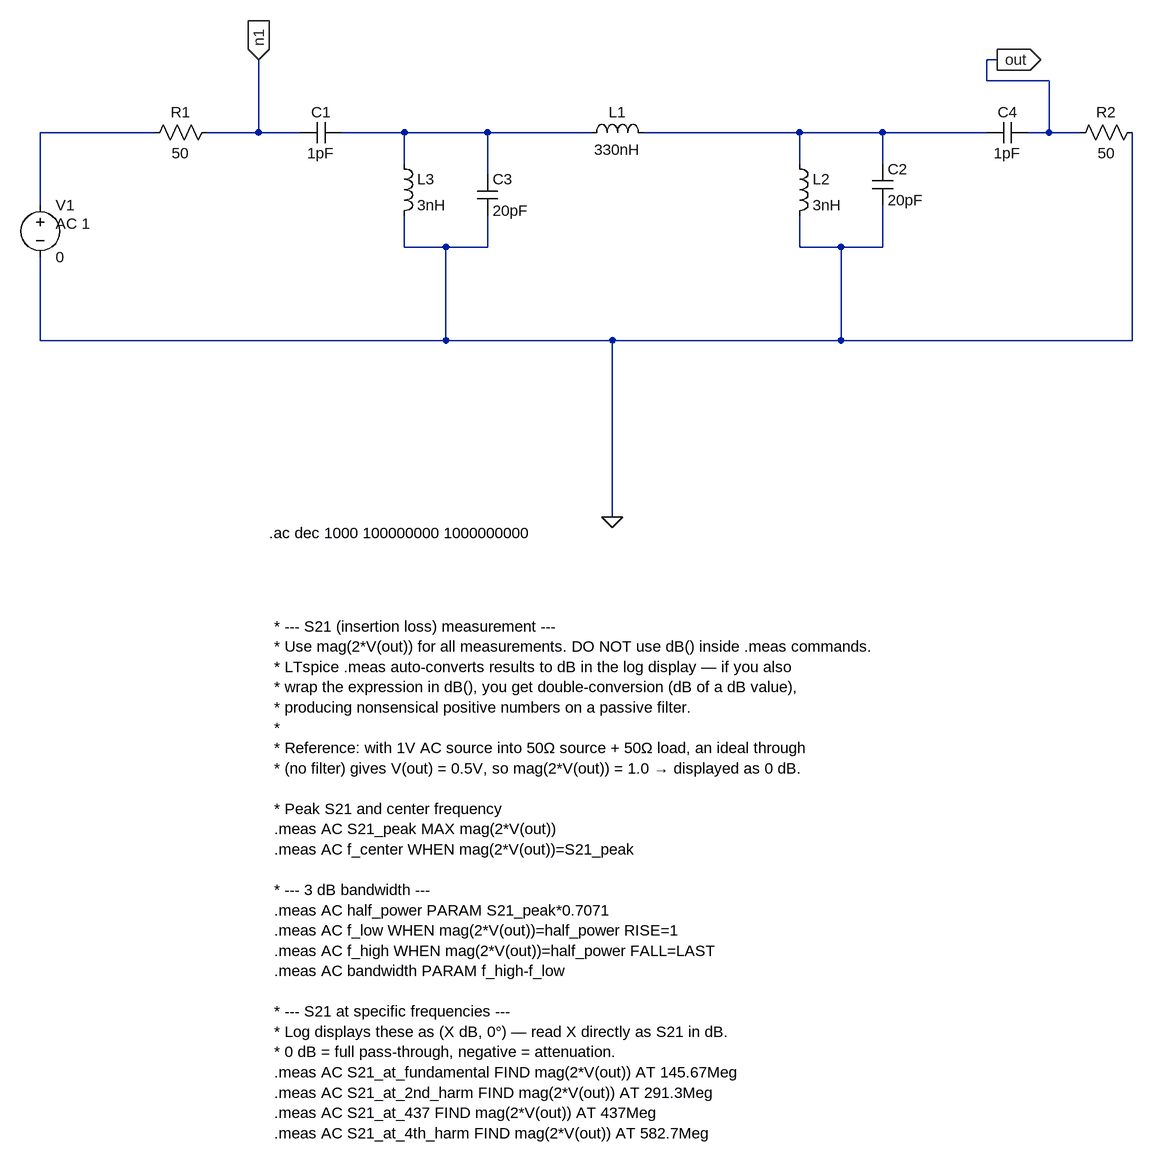
[diagram p0: schematic 437MHz_BPF_v01.asc]
437MHz_BPF_v01.asc, the LTspice schematic file:
Version 4.1
SHEET 1 1696 1124
WIRE 944 -464 928 -464
WIRE 928 -432 928 -464
WIRE 1024 -432 928 -432
WIRE -352 -352 -528 -352
WIRE -192 -352 -192 -464
WIRE -192 -352 -272 -352
WIRE -128 -352 -192 -352
WIRE 32 -352 -64 -352
WIRE 160 -352 32 -352
WIRE 320 -352 160 -352
WIRE 640 -352 400 -352
WIRE 768 -352 640 -352
WIRE 928 -352 768 -352
WIRE 1024 -352 1024 -432
WIRE 1024 -352 992 -352
WIRE 1072 -352 1024 -352
WIRE 32 -304 32 -352
WIRE 640 -304 640 -352
WIRE 768 -304 768 -352
WIRE 160 -288 160 -352
WIRE -528 -240 -528 -352
WIRE 32 -176 32 -224
WIRE 96 -176 32 -176
WIRE 160 -176 160 -224
WIRE 160 -176 96 -176
WIRE 640 -176 640 -224
WIRE 704 -176 640 -176
WIRE 768 -176 768 -240
WIRE 768 -176 704 -176
WIRE -528 -32 -528 -160
WIRE 96 -32 96 -176
WIRE 96 -32 -528 -32
WIRE 352 -32 96 -32
WIRE 704 -32 704 -176
WIRE 704 -32 352 -32
WIRE 1152 -32 1152 -352
WIRE 1152 -32 704 -32
WIRE 352 240 352 -32
FLAG 352 240 0
FLAG 944 -464 out
IOPIN 944 -464 Out
FLAG -192 -464 n1
IOPIN -192 -464 In
SYMBOL ind 304 -336 R270
WINDOW 0 32 56 VTop 2
WINDOW 3 5 56 VBottom 2
SYMATTR InstName L1
SYMATTR Value 330nH
SYMBOL ind 624 -320 R0
SYMATTR InstName L2
SYMATTR Value 3nH
SYMBOL ind 16 -320 R0
SYMATTR InstName L3
SYMATTR Value 3nH
SYMBOL cap 752 -304 R0
SYMATTR InstName C2
SYMATTR Value 20pF
SYMBOL cap 144 -288 R0
SYMATTR InstName C3
SYMATTR Value 20pF
SYMBOL cap 992 -368 R90
WINDOW 0 0 32 VBottom 2
WINDOW 3 32 32 VTop 2
SYMATTR InstName C4
SYMATTR Value 1pF
SYMBOL cap -64 -368 R90
WINDOW 0 0 32 VBottom 2
WINDOW 3 32 32 VTop 2
SYMATTR InstName C1
SYMATTR Value 1pF
SYMBOL res -256 -368 R90
WINDOW 0 0 56 VBottom 2
WINDOW 3 32 56 VTop 2
SYMATTR InstName R1
SYMATTR Value 50
SYMBOL res 1168 -368 R90
WINDOW 0 0 56 VBottom 2
WINDOW 3 32 56 VTop 2
SYMATTR InstName R2
SYMATTR Value 50
SYMBOL voltage -528 -256 R0
WINDOW 123 24 44 Left 2
WINDOW 39 0 0 Left 0
SYMATTR InstName V1
SYMATTR Value 0
SYMATTR Value2 AC 1
TEXT -176 264 Left 2 !.ac dec 1000 100000000 1000000000
TEXT -168 408 Left 2 !* --- S21 (insertion loss) measurement ---\n* Use mag(2*V(out)) for all measurements. DO NOT use dB() inside .meas commands.\n* LTspice .meas auto-converts results to dB in the log display — if you also\n* wrap the expression in dB(), you get double-conversion (dB of a dB value),\n* producing nonsensical positive numbers on a passive filter.\n*\n* Reference: with 1V AC source into 50Ω source + 50Ω load, an ideal through\n* (no filter) gives V(out) = 0.5V, so mag(2*V(out)) = 1.0 → displayed as 0 dB.\n \n* Peak S21 and center frequency\n.meas AC S21_peak MAX mag(2*V(out))\n.meas AC f_center WHEN mag(2*V(out))=S21_peak\n \n* --- 3 dB bandwidth ---\n.meas AC half_power PARAM S21_peak*0.7071\n.meas AC f_low WHEN mag(2*V(out))=half_power RISE=1\n.meas AC f_high WHEN mag(2*V(out))=half_power FALL=LAST\n.meas AC bandwidth PARAM f_high-f_low\n \n* --- S21 at specific frequencies ---\n* Log displays these as (X dB, 0°) — read X directly as S21 in dB.\n* 0 dB = full pass-through, negative = attenuation.\n.meas AC S21_at_fundamental FIND mag(2*V(out)) AT 145.67Meg\n.meas AC S21_at_2nd_harm FIND mag(2*V(out)) AT 291.3Meg\n.meas AC S21_at_437 FIND mag(2*V(out)) AT 437Meg\n.meas AC S21_at_4th_harm FIND mag(2*V(out)) AT 582.7Meg

The netlist it stands for:
* 437MHz_BPF_v01.asc
L1 N002 N003 330nH
L2 N003 0 3nH
L3 N002 0 3nH
C2 N003 0 20pF
C3 N002 0 20pF
C4 out N003 1pF
C1 N002 n1 1pF
R1 n1 N001 50
R2 0 out 50
V1 N001 0 0 AC 1
.ac dec 1000 100000000 1000000000
* --- S21 (insertion loss) measurement ---
* Use mag(2*V(out)) for all measurements. DO NOT use dB() inside .meas commands.
* LTspice .meas auto-converts results to dB in the log display — if you also
* wrap the expression in dB(), you get double-conversion (dB of a dB value),
* producing nonsensical positive numbers on a passive filter.
*
* Reference: with 1V AC source into 50Ω source + 50Ω load, an ideal through
* (no filter) gives V(out) = 0.5V, so mag(2*V(out)) = 1.0 → displayed as 0 dB.
* Peak S21 and center frequency
.meas AC S21_peak MAX mag(2*V(out))
.meas AC f_center WHEN mag(2*V(out))=S21_peak
* --- 3 dB bandwidth ---
.meas AC half_power PARAM S21_peak*0.7071
.meas AC f_low WHEN mag(2*V(out))=half_power RISE=1
.meas AC f_high WHEN mag(2*V(out))=half_power FALL=LAST
.meas AC bandwidth PARAM f_high-f_low
* --- S21 at specific frequencies ---
* Log displays these as (X dB, 0°) — read X directly as S21 in dB.
* 0 dB = full pass-through, negative = attenuation.
.meas AC S21_at_fundamental FIND mag(2*V(out)) AT 145.67Meg
.meas AC S21_at_2nd_harm FIND mag(2*V(out)) AT 291.3Meg
.meas AC S21_at_437 FIND mag(2*V(out)) AT 437Meg
.meas AC S21_at_4th_harm FIND mag(2*V(out)) AT 582.7Meg
.backanno
.end